# EAGLE design DobbelSteen_with_programing_header (EAGLE 6.5.0)
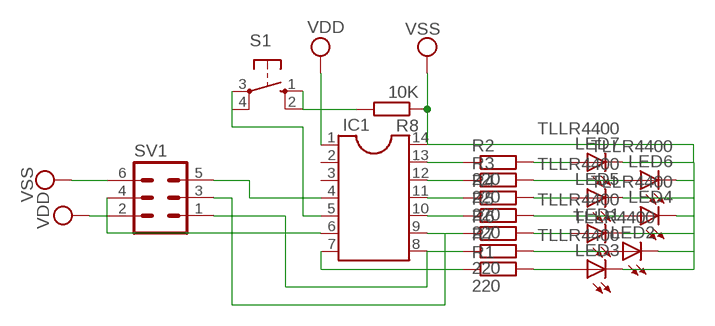
[diagram p0: schematic, sheet 1]

## Parts
IC1  DIL14S  [SOCKET-14]
LED1  TLLR4400  [LED3MM]
LED2  TLLR4400  [LED3MM]
LED3  TLLR4400  [LED3MM]
LED4  TLLR4400  [LED3MM]
LED5  TLLR4400  [LED3MM]
LED6  TLLR4400  [LED3MM]
LED7  TLLR4400  [LED3MM]
R1  220  R0204/7  [0204/7]
R2  220  R0204/7  [0204/7]
R3  220  R0204/7  [0204/7]
R4  220  R0204/7  [0204/7]
R5  220  R0204/7  [0204/7]
R6  R0204/7  [0204/7]
R7  220  R0204/7  [0204/7]
R8  10K  R0204/7  [0204/7]
S1  10-XX  [B3F-10XX]
SV1  MA03-2  [MA03-2]

## Nets
N$1: IC1.13 R2.1
N$2: IC1.12 R3.1
N$3: IC1.11 R4.1
N$4: IC1.10 R5.1
N$6: IC1.8 R7.1 SV1.1
N$7: IC1.7 R1.1
N$8: LED7.A R2.2
N$9: LED6.A R3.2
N$10: LED5.A R4.2
N$11: LED4.A R5.2
N$12: LED1.A R6.2
N$13: LED2.A R7.2
N$14: LED3.A R1.2
N$15: IC1.6 SV1.4
N$16: R8.2 S1.1(S) S1.2(S1)
N$17: IC1.5 S1.3(P) S1.4(P1)
N$18: IC1.4 SV1.5
N$19: IC1.9 R6.1 SV1.3
VDD: IC1.1 SV1.2
VSS: IC1.14 LED1.K(C) LED2.K(C) LED3.K(C) LED4.K(C) LED5.K(C) LED6.K(C) LED7.K(C) R8.1 SV1.6
Unconnected: IC1.2 IC1.3

## Library data of the parts
IC1 = ic-package:DIL14: Dual In Line / Socket
LED1-LED7 = led:TLLR4400: Low Current (2mA) LED 3 mm Tinted Diffused Package color RED Source: Data sheet <http://www.farnell.com/datasheets/391100.pdf>; MF: VISHAY SEMICONDUCTOR; OC_FARNELL: 1612437
R1-R8 = eagle-ltspice:R: RESISTOR, European symbol; SPICEMODEL: NONE; SPICEPREFIX: R
S1 = switch-omron:10-XX: OMRON SWITCH; MPN: B3F-1000; OC_FARNELL: 176432; OC_NEWARK: 36M3542
SV1 = con-lstb:MA03-2: PIN HEADER; OC_FARNELL: unknown; OC_NEWARK: unknown

## Board
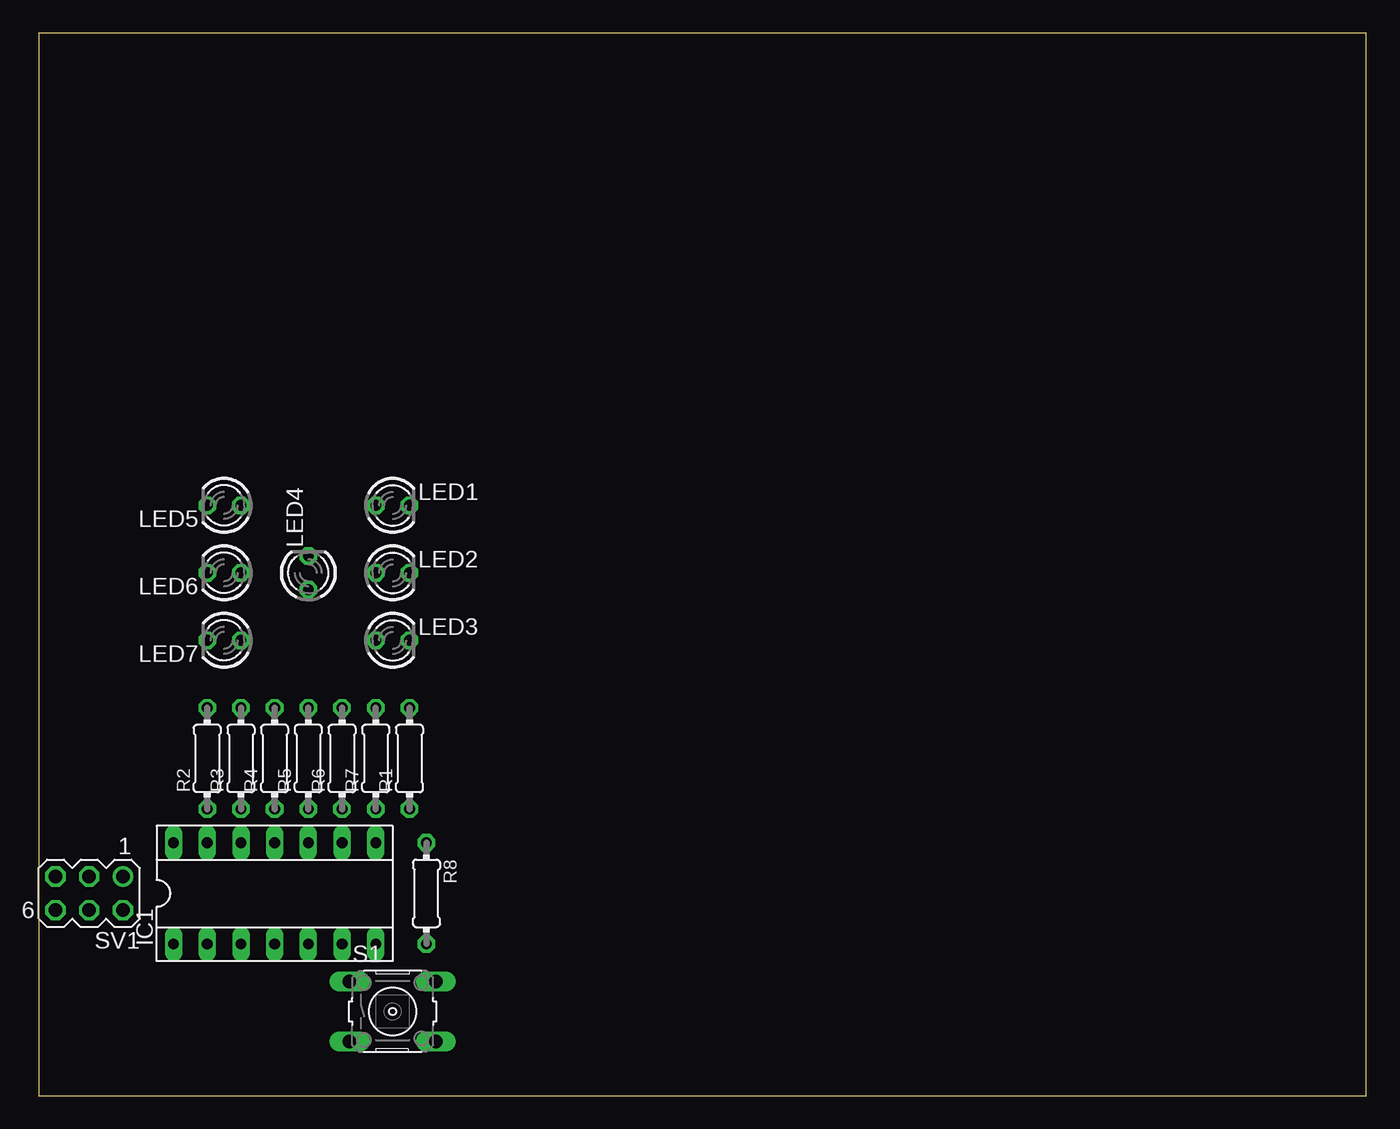
[diagram p1: board, top side]
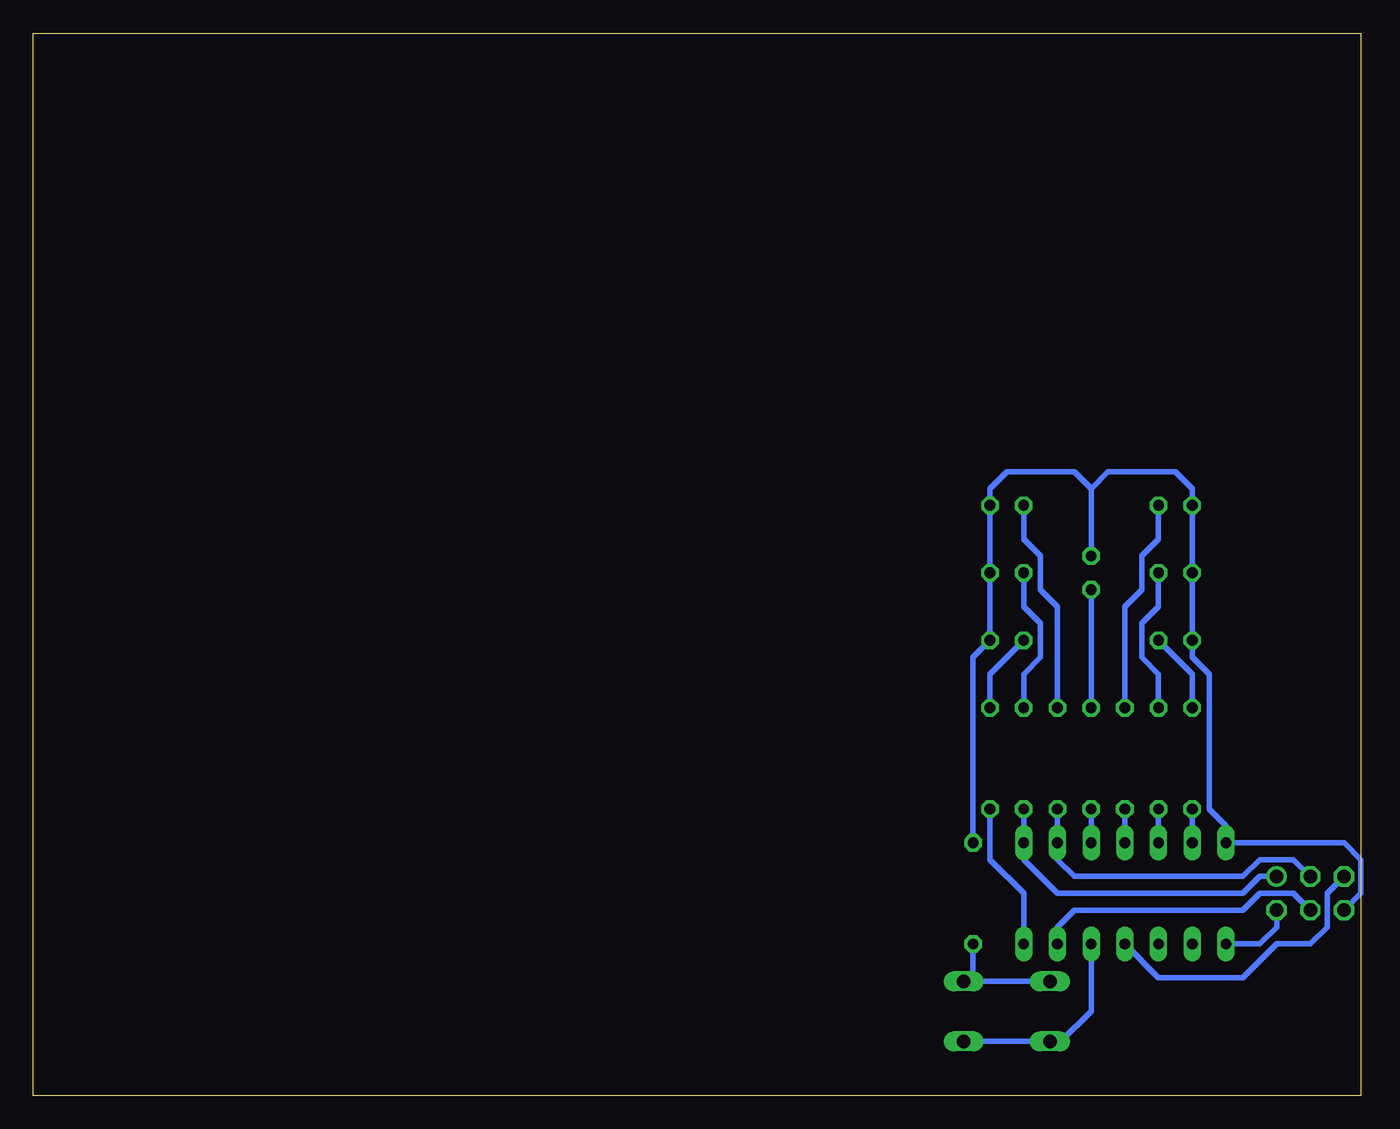
[diagram p2: board, bottom side, seen from below]

Size 100 x 80 mm. Coordinates in mm from the lower left corner, seen from the top.
Outline: 0,0 100,0 100,80 0,80 0,0
Copper layers (1*16): Top 0.035mm / dielectric 1.5mm / Bottom 0.035mm
Design rules "default": minimum track width 10mil, minimum drill 24mil, track to track 8mil, track to pad 8mil, pad to pad 8mil, via to via 8mil, smd to smd 8mil, copper to edge 40mil, drill to drill 8mil, minimum pad ring 10mil, minimum via ring 8mil, stop-mask expansion 4mil, vias tented up to drill 0mil, thermal gap 10mil

### Footprints (pad centres in the part's own frame; a part is rotated, then mirrored left to right if it is on the bottom)
SOCKET-14 = drill 0.813 long: 1 -7.62,-3.81; 2 -5.08,-3.81; 3 -2.54,-3.81; 4 0,-3.81; 5 2.54,-3.81; 6 5.08,-3.81; 7 7.62,-3.81; 8 7.62,3.81; 9 5.08,3.81; 10 2.54,3.81; 11 0,3.81; 12 -2.54,3.81; 13 -5.08,3.81; 14 -7.62,3.81
LED3MM = drill 0.813 octagon: A -1.27,0; K 1.27,0
0204/7 = drill 0.813 octagon: 1 -3.81,0; 2 3.81,0
B3F-10XX = drill 1.016 long: 1 -3.251,2.261; 2 3.251,2.261; 3 -3.251,-2.261; 4 3.251,-2.261
MA03-2 = drill 1.016: 1 -2.54,-1.27 | drill 1.016 octagon: 2 -2.54,1.27; 3 0,-1.27; 4 0,1.27; 5 2.54,-1.27; 6 2.54,1.27

### Placement (x,y rotation side)
IC1  17.78,15.24 0 top
LED1  26.67,44.45 0 top
LED2  26.67,39.37 0 top
LED3  26.67,34.29 0 top
LED4  20.32,39.37 90 top
LED5  13.97,44.45 180 top
LED6  13.97,39.37 180 top
LED7  13.97,34.29 180 top
R1  27.94,25.4 90 top
R2  12.7,25.4 90 top
R3  15.24,25.4 90 top
R4  17.78,25.4 90 top
R5  20.32,25.4 90 top
R6  22.86,25.4 90 top
R7  25.4,25.4 90 top
R8  29.21,15.24 270 top
S1  26.67,6.35 0 top
SV1  3.81,15.24 180 top

### Tracks (layer width: path | path; a pad name or v marks a point on that pad's centre or on a via)
N$1
  Bottom 0.406: R2.1 IC1.13
N$2
  Bottom 0.406: R3.1 IC1.12
N$3
  Bottom 0.406: R4.1 IC1.11
N$4
  Bottom 0.406: R5.1 IC1.10
N$6
  Bottom 0.406: R7.1 IC1.8 25.4,17.78 22.86,15.24 8.89,15.24 7.62,16.51 SV1.1
N$7
  Bottom 0.406: R1.1 27.94,17.78 25.4,15.24 IC1.7
N$8
  Bottom 0.406: R2.2 12.7,31.75 LED7.A
N$9
  Bottom 0.406: R3.2 15.24,31.75 16.51,33.02 16.51,35.56 15.24,36.83 LED6.A
N$10
  Bottom 0.406: R4.2 17.78,36.83 16.51,38.1 16.51,40.64 15.24,41.91 LED5.A
N$11
  Bottom 0.406: R5.2 LED4.A
N$12
  Bottom 0.406: R6.2 22.86,36.83 24.13,38.1 24.13,40.64 25.4,41.91 LED1.A
N$13
  Bottom 0.406: R7.2 25.4,31.75 24.13,33.02 24.13,35.56 25.4,36.83 LED2.A
N$14
  Bottom 0.406: R1.2 27.94,31.75 LED3.A
N$15
  Bottom 0.406: IC1.6 22.86,12.7 21.59,13.97 8.89,13.97 7.62,15.24 5.08,15.24 SV1.4
N$16
  Bottom 0.406: S1.2 29.21,8.61 | 29.21,8.61 S1.1 | R8.2 29.21,8.61
N$17
  Bottom 0.406: S1.4 S1.3 22.58,4.09 20.32,6.35 IC1.5
N$18
  Bottom 0.406: SV1.5 2.54,15.24 2.54,12.7 3.81,11.43 6.35,11.43 8.89,8.89 15.24,8.89 IC1.4
N$19
  Bottom 0.406: R6.1 IC1.9 22.86,17.78 21.59,16.51 8.89,16.51 7.62,17.78 5.08,17.78 SV1.3
VDD
  Bottom 0.406: SV1.2 6.35,12.7 7.62,11.43 IC1.1
VSS
  Bottom 0.406: 20.32,45.72 21.59,46.99 26.67,46.99 27.94,45.72 LED1.K LED2.K LED3.K 29.21,33.02 R8.1 | LED4.K 20.32,45.72 | 20.32,45.72 19.05,46.99 13.97,46.99 12.7,45.72 LED5.K LED6.K LED7.K 12.7,33.02 11.43,31.75 11.43,21.59 10.16,20.32 IC1.14 1.27,19.05 0,17.78 0,15.24 SV1.6